# Altium schematic sheet MCU_STM32H723ZGT6.SchDoc: STM32F446 CNC
size C; Author: AM; CompanyName: Expatria Technologies; DrawnBy: A.Marles; Engineer: AM; Organization: Expatria Technologies; DocumentNumber: 3; SheetNumber: 3; SheetTotal: 14
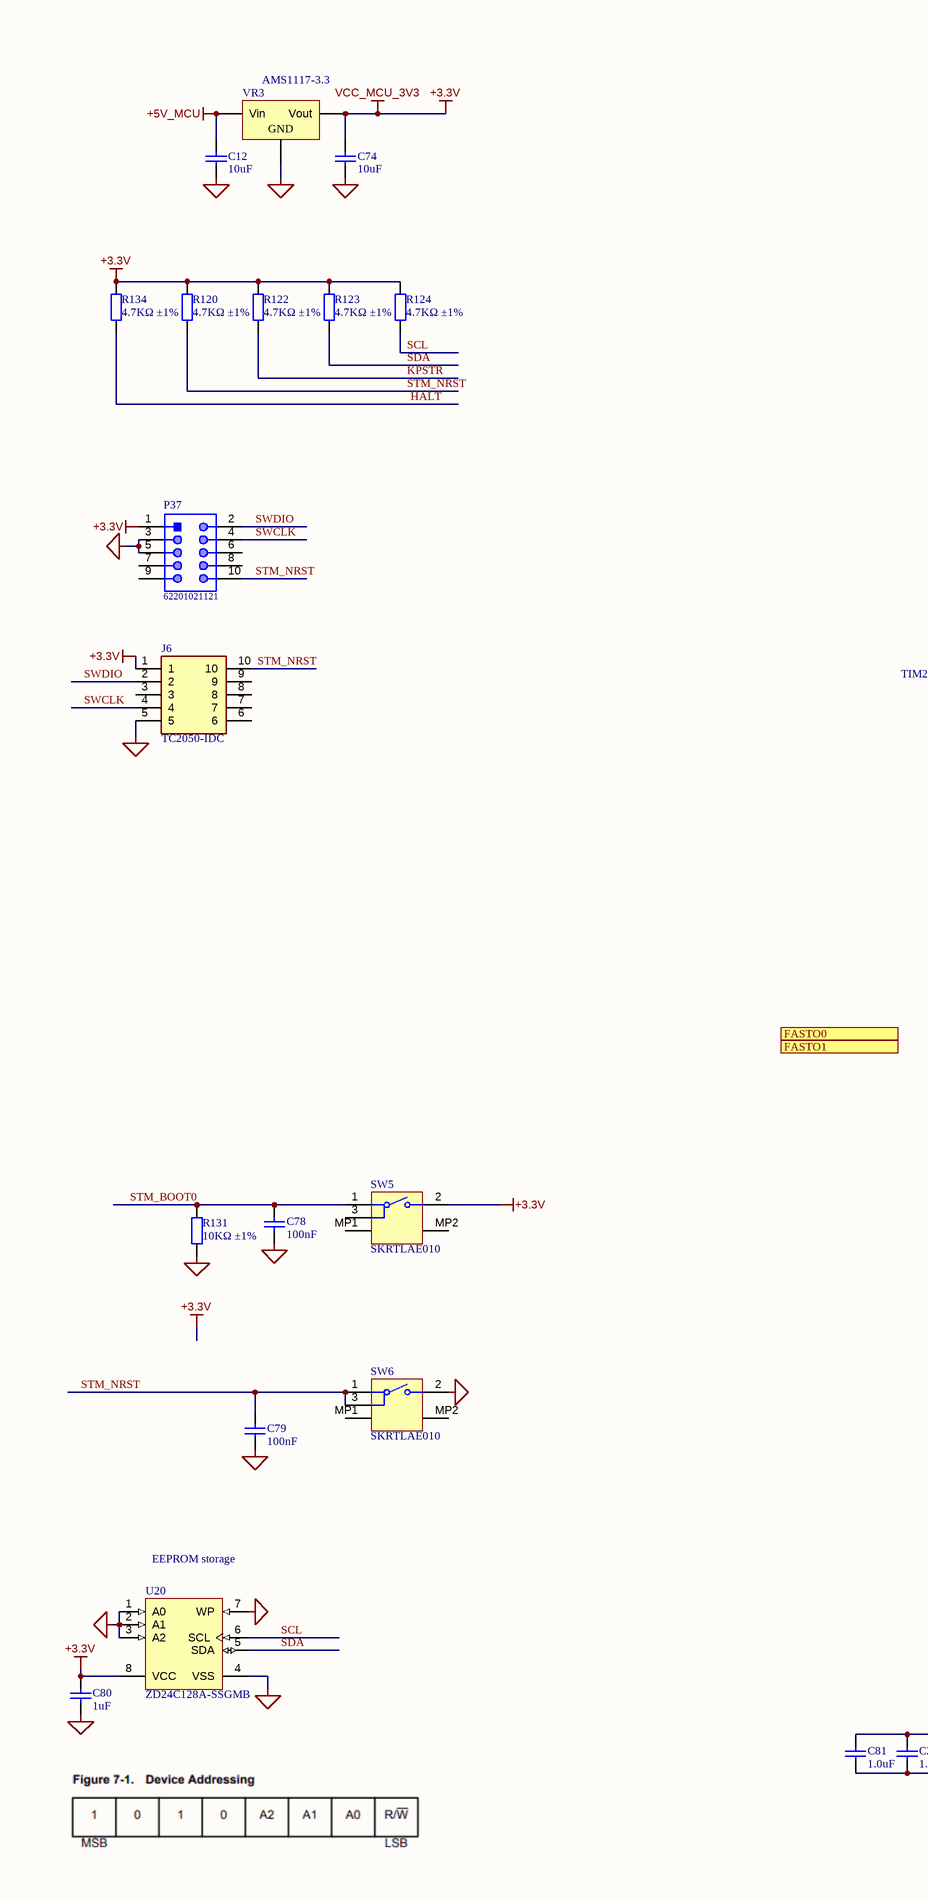
[diagram p0: MCU_STM32H723ZGT6.SchDoc, left]
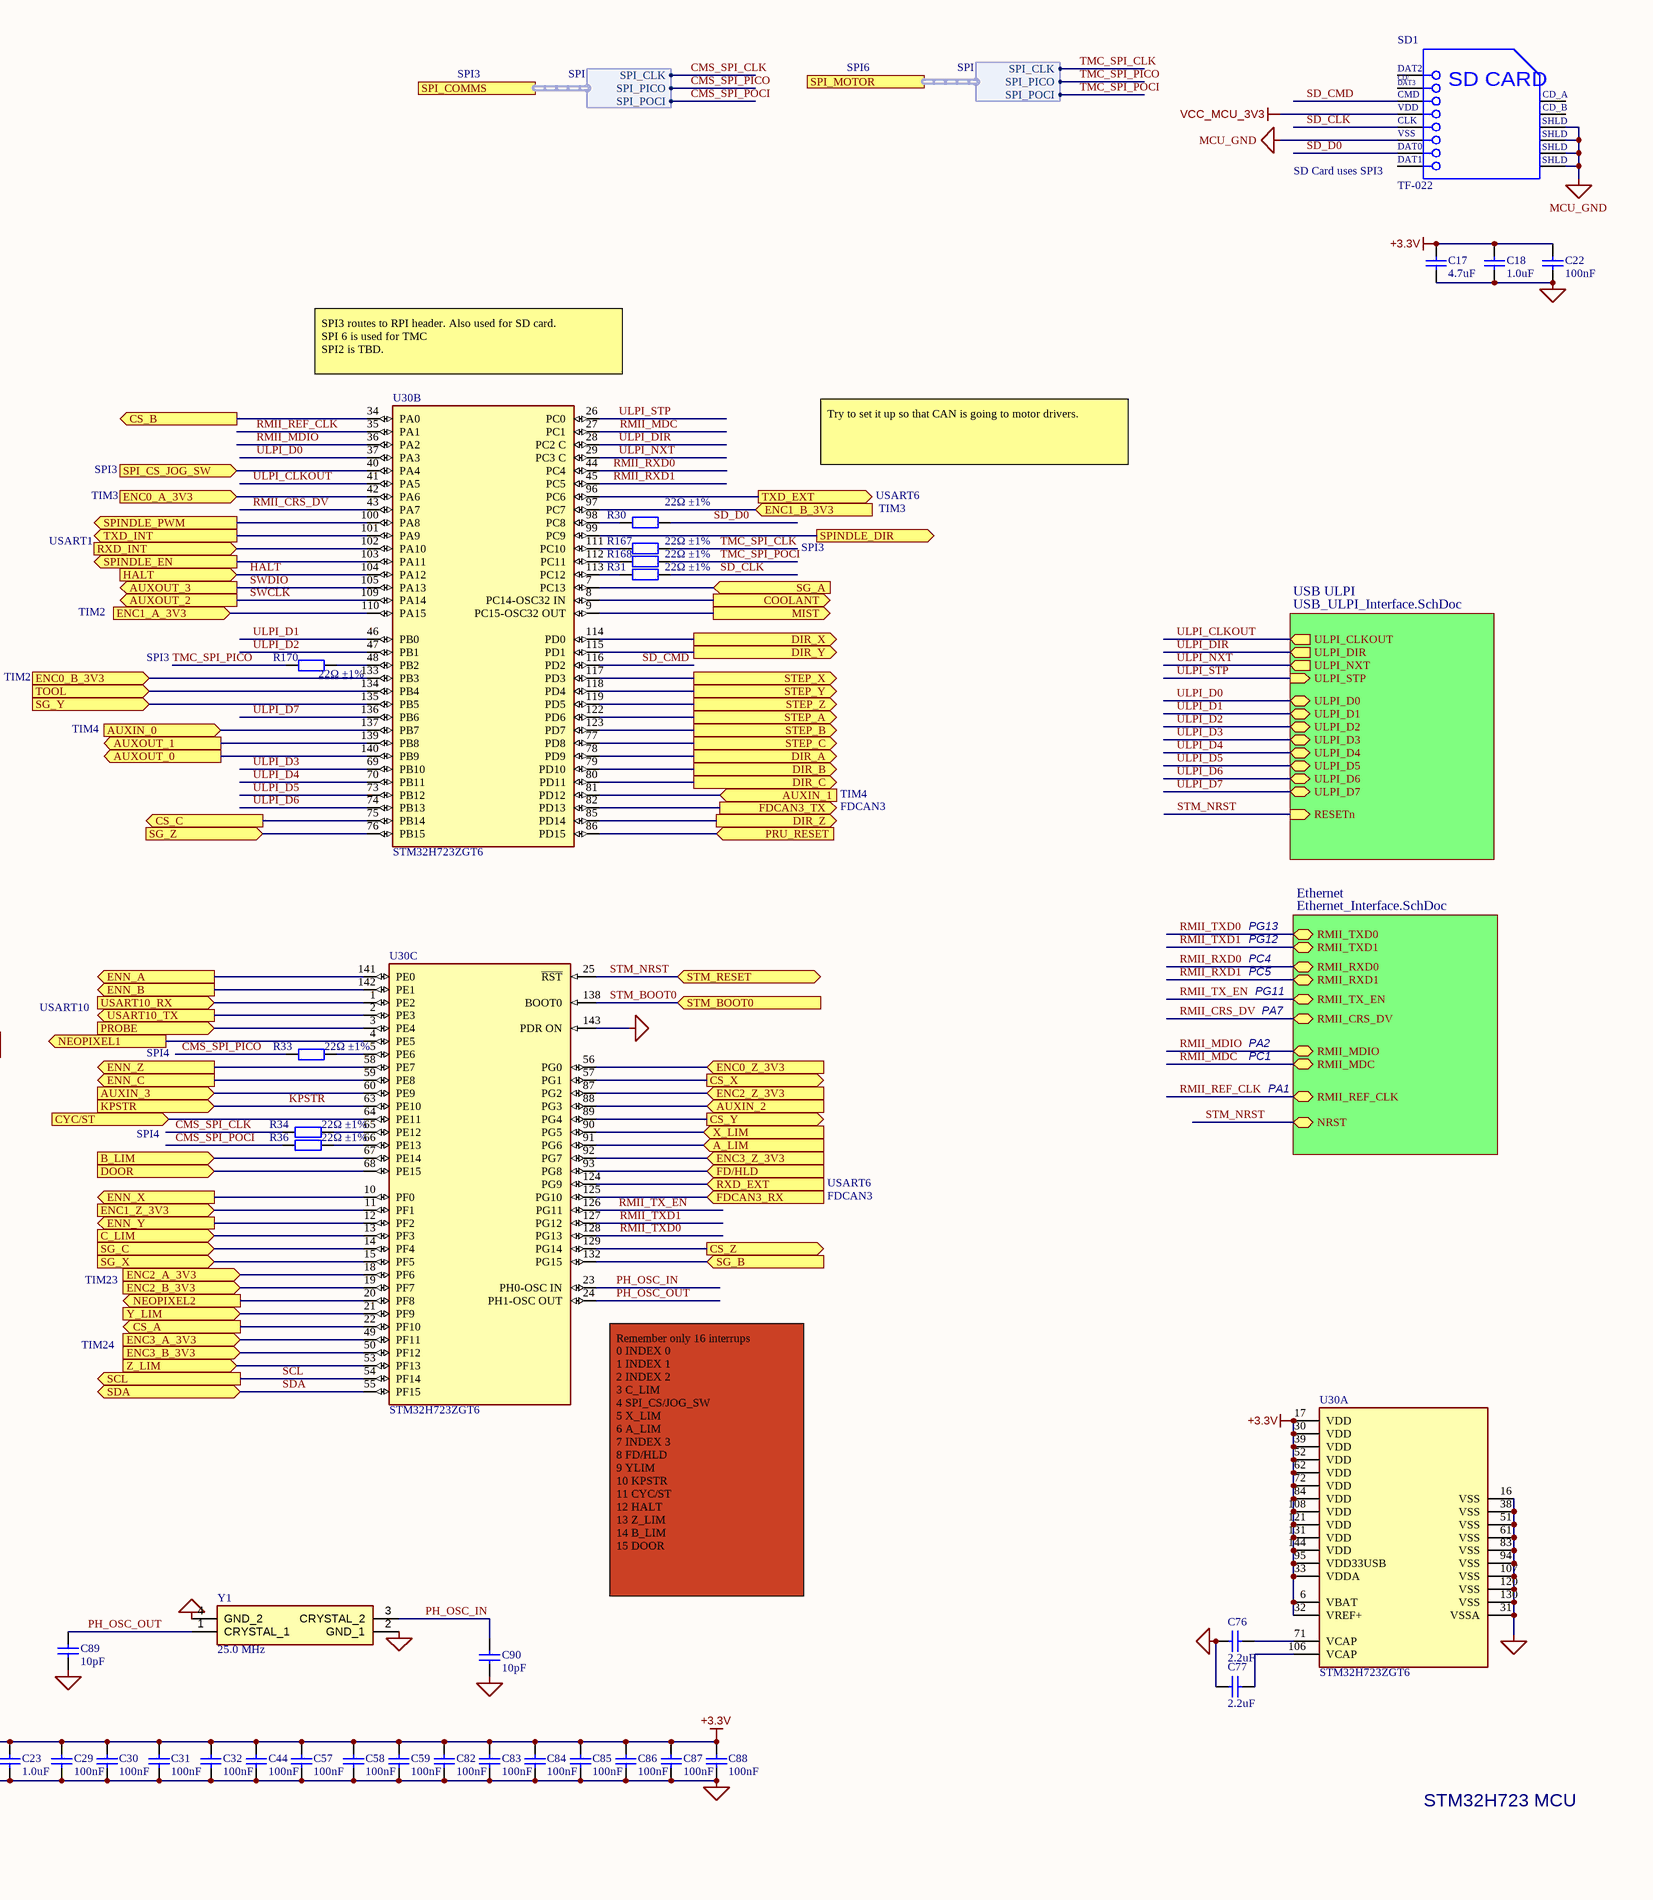
[diagram p1: MCU_STM32H723ZGT6.SchDoc, right]

## Parts
C12  10uF  [1206_C]
C17  4.7uF  [0603_C]
C18  1.0uF  [0402_C]
C22  100nF  [0402_C]
C23  1.0uF  [0402_C]
C29  100nF  [0402_C]
C30  100nF  [0402_C]
C31  100nF  [0402_C]
C32  100nF  [0402_C]
C44  100nF  [0402_C]
C57  100nF  [0402_C]
C58  100nF  [0402_C]
C59  100nF  [0402_C]
C74  10uF  [1206_C]
C76  2.2uF  [0603_C]
C77  2.2uF  [0603_C]
C78  100nF  [0603_C]
C79  100nF  [0603_C]
C80  1uF  [0603_C]
C81  1.0uF  [0402_C]
C82  100nF  [0402_C]
C83  100nF  [0402_C]
C84  100nF  [0402_C]
C85  100nF  [0402_C]
C86  100nF  [0402_C]
C87  100nF  [0402_C]
C88  100nF  [0402_C]
C89  10pF  [0402_C]
C90  10pF  [0402_C]
J6  TC2050-IDC  [TC2050-IDC]
P37  62201021121  [62201021121]  (no BOM)
R30  22Ω ±1%  [0402_R]
R31  22Ω ±1%  [0402_R]
R33  22Ω ±1%  [0402_R]
R34  22Ω ±1%  [0402_R]
R36  22Ω ±1%  [0402_R]
R120  4.7KΩ ±1%  [0603_R]
R122  4.7KΩ ±1%  [0603_R]
R123  4.7KΩ ±1%  [0603_R]
R124  4.7KΩ ±1%  [0603_R]
R131  10KΩ ±1%  [0603_R]
R134  4.7KΩ ±1%  [0603_R]
R167  22Ω ±1%  [0402_R]
R168  22Ω ±1%  [0402_R]
R170  22Ω ±1%  [0402_R]
SD1  TF-022  [MOLX-503398-1892_V]
SW5  SKRTLAE010  [ALPS-SKRTLAE010_V]
SW6  SKRTLAE010  [ALPS-SKRTLAE010_V]
U20  ZD24C128A-SSGMB  [SOIC-SN8_L]
U30  STM32H723ZGT6  [FP-LQFP144-1A-IPC_A]  (parts A,B,C of 3)
VR3  AMS1117-3.3  [SOT-223]
Y1  25.0 MHz  [YSX321SL]

## Sub-sheets
Ethernet = Ethernet_Interface.SchDoc: RMII_RXD1 (bidir), RMII_MDC (bidir), RMII_REF_CLK (bidir), RMII_MDIO (bidir), RMII_RXD0 (bidir), RMII_TX_EN (bidir), NRST (bidir), RMII_CRS_DV (bidir), RMII_TXD0 (bidir), RMII_TXD1 (bidir)
USB ULPI = USB_ULPI_Interface.SchDoc: ULPI_D5 (bidir), ULPI_D7 (bidir), ULPI_D6 (bidir), ULPI_D4 (bidir), ULPI_D0 (bidir), ULPI_D2 (bidir), ULPI_D3 (bidir), ULPI_D1 (bidir), ULPI_NXT (out), ULPI_DIR (out), ULPI_STP (in), ULPI_CLKOUT (out), RESETn (in)

## Ports
A_LIM (in), AUXIN_0 (in), AUXIN_1 (in), AUXIN_2 (in), AUXIN_3 (in), AUXOUT_0 (out), AUXOUT_1 (out), AUXOUT_2 (out), AUXOUT_3 (out), B_LIM (in), C_LIM (in), COOLANT (out), CS_A (out), CS_B (out), CS_C (out), CS_X (out), CS_Y (out), CS_Z (out), CYC/ST (in), DIR_A (out), DIR_B (out), DIR_C (out), DIR_X (out), DIR_Y (out), DIR_Z (out), DOOR (in), ENC0_A_3V3 (in), ENC0_B_3V3 (in), ENC0_Z_3V3 (in), ENC1_A_3V3 (in), ENC1_B_3V3 (in), ENC1_Z_3V3 (in), ENC2_A_3V3 (in), ENC2_B_3V3 (in), ENC2_Z_3V3 (in), ENC3_A_3V3 (in), ENC3_B_3V3 (in), ENC3_Z_3V3 (in), ENN_A (out), ENN_B (out), ENN_C (out), ENN_X (out), ENN_Y (out), ENN_Z (out), FASTO0 (out), FASTO1 (out), FD/HLD (in), FDCAN3_RX (in), FDCAN3_TX (out), HALT (in), KPSTR (in), MIST (out), NEOPIXEL1 (out), NEOPIXEL2 (out), PROBE (in), PRU_RESET (in), RXD_EXT (in), RXD_INT (in), SCL (out), SDA (bidir), SG_A (in), SG_B (in), SG_C (in), SG_X (in), SG_Y (in), SG_Z (in), SPI_COMMS (harness SPI), SPI_CS_JOG_SW (in), SPI_MOTOR (harness SPI), SPINDLE_DIR (out), SPINDLE_EN (out), SPINDLE_PWM (out), STEP_A (out), STEP_B (out), STEP_C (out), STEP_X (out), STEP_Y (out), STEP_Z (out), STM_BOOT0 (in), STM_RESET (bidir), TOOL (in), TXD_EXT (out), TXD_INT (out), USART10_RX (in), USART10_TX (out), X_LIM (in), Y_LIM (in), Z_LIM (in)

## Harnesses
SPI: SPI_CLK, SPI_PICO, SPI_POCI

## Nets
+3.3V: C17.2 C18.2 C22.2 C23.2 C29.2 C30.2 C31.2 C32.2 C44.2 C57.2 C58.2 C59.2 C74.2 C80.2 C81.2 C82.2 C83.2 C84.2 C85.2 C86.2 C87.2 C88.2 J6.1 P37.1 R120.2 R122.2 R123.2 R124.2 R134.2 SD1.4(VDD) SW5.2 U20.8(VCC) U30.6(VBAT) U30.17(VDD) U30.30(VDD) U30.32(VREF+) U30.33(VDDA) U30.39(VDD) U30.52(VDD) U30.62(VDD) U30.72(VDD) U30.84(VDD) U30.95(VDD33USB) U30.108(VDD) U30.121(VDD) U30.131(VDD) U30.144(VDD) VR3.2(Vout)  [also labelled VCC_MCU_3V3]
+5V_MCU: C12.2 VR3.3(Vin)
MCU_GND: C12.1 C17.1 C18.1 C22.1 C23.1 C29.1 C30.1 C31.1 C32.1 C44.1 C57.1 C58.1 C59.1 C74.1 C76.1 C77.1 C78.1 C79.1 C80.1 C81.1 C82.1 C83.1 C84.1 C85.1 C86.1 C87.1 C88.1 C89.1 C90.1 J6.5 P37.3 P37.5 R131.2 SD1.6(VSS) SD1.11(SHLD) SD1.12(SHLD) SD1.13(SHLD) SD1.14(SHLD) SW6.2 U20.1(A0) U20.2(A1) U20.3(A2) U20.4(VSS) U20.7(WP) U30.16(VSS) U30.31(VSSA) U30.38(VSS) U30.51(VSS) U30.61(VSS) U30.83(VSS) U30.94(VSS) U30.107(VSS) U30.120(VSS) U30.130(VSS) U30.143(PDR_ON) VR3.1(GND) Y1.2(GND_1) Y1.4(GND_2)
A_LIM: U30.91(PG6) ; port A_LIM
AUXIN_0: U30.137(PB7) ; port AUXIN_0
AUXIN_1: U30.81(PD12) ; port AUXIN_1
AUXIN_2: U30.88(PG3) ; port AUXIN_2
AUXIN_3: U30.60(PE9) ; port AUXIN_3
AUXOUT_0: U30.140(PB9) ; port AUXOUT_0
AUXOUT_1: U30.139(PB8) ; port AUXOUT_1
B_LIM: U30.67(PE14) ; port B_LIM
C_LIM: U30.13(PF3) ; port C_LIM
CMS_SPI_CLK: R34.1 ; port SPI_COMMS.SPI_CLK
CMS_SPI_PICO: R33.1 ; port SPI_COMMS.SPI_PICO
CMS_SPI_POCI: R36.1 ; port SPI_COMMS.SPI_POCI
COOLANT: U30.8(PC14-OSC32_IN) ; port COOLANT
CS_A: U30.22(PF10) ; port CS_A
CS_B: U30.34(PA0) ; port CS_B
CS_C: U30.75(PB14) ; port CS_C
CS_X: U30.57(PG1) ; port CS_X
CS_Y: U30.89(PG4) ; port CS_Y
CS_Z: U30.129(PG14) ; port CS_Z
CYC/ST: U30.64(PE11) ; port CYC/ST
DIR_A: U30.78(PD9) ; port DIR_A
DIR_B: U30.79(PD10) ; port DIR_B
DIR_C: U30.80(PD11) ; port DIR_C
DIR_X: U30.114(PD0) ; port DIR_X
DIR_Y: U30.115(PD1) ; port DIR_Y
DIR_Z: U30.85(PD14) ; port DIR_Z
DOOR: U30.68(PE15) ; port DOOR
ENC0_A_3V3: U30.42(PA6) ; port ENC0_A_3V3
ENC0_B_3V3: U30.133(PB3) ; port ENC0_B_3V3
ENC0_Z_3V3: U30.56(PG0) ; port ENC0_Z_3V3
ENC1_A_3V3: U30.110(PA15) ; port ENC1_A_3V3
ENC1_B_3V3: U30.97(PC7) ; port ENC1_B_3V3
ENC1_Z_3V3: U30.11(PF1) ; port ENC1_Z_3V3
ENC2_A_3V3: U30.18(PF6) ; port ENC2_A_3V3
ENC2_B_3V3: U30.19(PF7) ; port ENC2_B_3V3
ENC2_Z_3V3: U30.87(PG2) ; port ENC2_Z_3V3
ENC3_A_3V3: U30.49(PF11) ; port ENC3_A_3V3
ENC3_B_3V3: U30.50(PF12) ; port ENC3_B_3V3
ENC3_Z_3V3: U30.92(PG7) ; port ENC3_Z_3V3
ENN_A: U30.141(PE0) ; port ENN_A
ENN_B: U30.142(PE1) ; port ENN_B
ENN_C: U30.59(PE8) ; port ENN_C
ENN_X: U30.10(PF0) ; port ENN_X
ENN_Y: U30.12(PF2) ; port ENN_Y
ENN_Z: U30.58(PE7) ; port ENN_Z
FD/HLD: U30.93(PG8) ; port FD/HLD
FDCAN3_RX: U30.125(PG10) ; port FDCAN3_RX
FDCAN3_TX: U30.82(PD13) ; port FDCAN3_TX
HALT: R134.1 U30.104(PA12) ; port HALT
KPSTR: R122.1 U30.63(PE10) ; port KPSTR
MIST: U30.9(PC15-OSC32_OUT) ; port MIST
NEOPIXEL1: U30.4(PE5) ; port NEOPIXEL1
NEOPIXEL2: U30.20(PF8) ; port NEOPIXEL2
PH_OSC_IN: C90.2 U30.23(PH0-OSC_IN) Y1.3(CRYSTAL_2)
PH_OSC_OUT: C89.2 U30.24(PH1-OSC_OUT) Y1.1(CRYSTAL_1)
PROBE: U30.3(PE4) ; port PROBE
PRU_RESET: U30.86(PD15) ; port PRU_RESET
RMII_CRS_DV: U30.43(PA7) ; sheet Ethernet/RMII_CRS_DV
RMII_MDC: U30.27(PC1) ; sheet Ethernet/RMII_MDC
RMII_MDIO: U30.36(PA2) ; sheet Ethernet/RMII_MDIO
RMII_REF_CLK: U30.35(PA1) ; sheet Ethernet/RMII_REF_CLK
RMII_RXD0: U30.44(PC4) ; sheet Ethernet/RMII_RXD0
RMII_RXD1: U30.45(PC5) ; sheet Ethernet/RMII_RXD1
RMII_TX_EN: U30.126(PG11) ; sheet Ethernet/RMII_TX_EN
RMII_TXD0: U30.128(PG13) ; sheet Ethernet/RMII_TXD0
RMII_TXD1: U30.127(PG12) ; sheet Ethernet/RMII_TXD1
RXD_EXT: U30.124(PG9) ; port RXD_EXT
RXD_INT: U30.102(PA10) ; port RXD_INT
SCL: R124.1 U20.6(SCL) U30.54(PF14) ; port SCL
SD_CLK: R31.2 SD1.5(CLK)
SD_CMD: SD1.3(CMD) U30.116(PD2)
SD_D0: R30.2 SD1.7(DAT0)
SDA: R123.1 U20.5(SDA) U30.55(PF15) ; port SDA
SG_A: U30.7(PC13) ; port SG_A
SG_B: U30.132(PG15) ; port SG_B
SG_C: U30.14(PF4) ; port SG_C
SG_X: U30.15(PF5) ; port SG_X
SG_Y: U30.135(PB5) ; port SG_Y
SG_Z: U30.76(PB15) ; port SG_Z
SPI_CS_JOG_SW: U30.40(PA4) ; port SPI_CS_JOG_SW
SPINDLE_DIR: U30.99(PC9) ; port SPINDLE_DIR
SPINDLE_EN: U30.103(PA11) ; port SPINDLE_EN
SPINDLE_PWM: U30.100(PA8) ; port SPINDLE_PWM
STEP_A: U30.122(PD6) ; port STEP_A
STEP_B: U30.123(PD7) ; port STEP_B
STEP_C: U30.77(PD8) ; port STEP_C
STEP_X: U30.117(PD3) ; port STEP_X
STEP_Y: U30.118(PD4) ; port STEP_Y
STEP_Z: U30.119(PD5) ; port STEP_Z
STM_BOOT0: C78.2 R131.1 SW5.1 U30.138(BOOT0) ; port STM_BOOT0
STM_NRST: C79.2 J6.10 P37.10 R120.1 SW6.1 SW6.3 U30.25(~{RST}) ; port STM_RESET, sheet Ethernet/NRST, sheet USB ULPI/RESETn
SWCLK: J6.4 P37.4 U30.109(PA14) ; port AUXOUT_2
SWDIO: J6.2 P37.2 U30.105(PA13) ; port AUXOUT_3
TMC_SPI_CLK: R167.2 ; port SPI_MOTOR.SPI_CLK
TMC_SPI_PICO: R170.1 ; port SPI_MOTOR.SPI_PICO
TMC_SPI_POCI: R168.2 ; port SPI_MOTOR.SPI_POCI
TOOL: U30.134(PB4) ; port TOOL
TXD_EXT: U30.96(PC6) ; port TXD_EXT
TXD_INT: U30.101(PA9) ; port TXD_INT
ULPI_CLKOUT: U30.41(PA5) ; sheet USB ULPI/ULPI_CLKOUT
ULPI_D0: U30.37(PA3) ; sheet USB ULPI/ULPI_D0
ULPI_D1: U30.46(PB0) ; sheet USB ULPI/ULPI_D1
ULPI_D2: U30.47(PB1) ; sheet USB ULPI/ULPI_D2
ULPI_D3: U30.69(PB10) ; sheet USB ULPI/ULPI_D3
ULPI_D4: U30.70(PB11) ; sheet USB ULPI/ULPI_D4
ULPI_D5: U30.73(PB12) ; sheet USB ULPI/ULPI_D5
ULPI_D6: U30.74(PB13) ; sheet USB ULPI/ULPI_D6
ULPI_D7: U30.136(PB6) ; sheet USB ULPI/ULPI_D7
ULPI_DIR: U30.28(PC2_C) ; sheet USB ULPI/ULPI_DIR
ULPI_NXT: U30.29(PC3_C) ; sheet USB ULPI/ULPI_NXT
ULPI_STP: U30.26(PC0) ; sheet USB ULPI/ULPI_STP
USART10_RX: U30.1(PE2) ; port USART10_RX
USART10_TX: U30.2(PE3) ; port USART10_TX
X_LIM: U30.90(PG5) ; port X_LIM
Y_LIM: U30.21(PF9) ; port Y_LIM
Z_LIM: U30.53(PF13) ; port Z_LIM
NetC76_2: C76.2 U30.71(VCAP)
NetC77_2: C77.2 U30.106(VCAP)
NetR30_1: R30.1 U30.98(PC8)
NetR31_1: R31.1 U30.113(PC12)
NetR33_2: R33.2 U30.5(PE6)
NetR34_2: R34.2 U30.65(PE12)
NetR36_2: R36.2 U30.66(PE13)
NetR167_1: R167.1 U30.111(PC10)
NetR168_1: R168.1 U30.112(PC11)
NetR170_2: R170.2 U30.48(PB2)

Not connected (* = marked no-connect by the designer): J6 3 6 7 8 9; P37 6 7 8 9; SD1 1(DAT2) 2(CD/DAT3) 8(DAT1) 9(CD_A) 10(CD_B); SW5 3 MP1 MP2; SW6 MP1 MP2

## Notes on the sheet
- SPI6
- SPI3
- (near SD1) SD Card uses SPI3
- (near U30) SPI3 routes to RPI header. Also used for SD card.
  SPI 6 is used for TMC
  SPI2 is TBD.
- Try to set it up so that CAN is going to motor drivers.
- TIM3
- USART6
- USART1
- TIM2
- TIM4
- FDCAN3
- PG13
- PG12
- PC4
- PC5
- USART10
- PA2
- PG11
- PA7
- SPI4
- PC1
- PA1
- TIM23
- TIM24
- (near U20) EEPROM storage
- (near U30) Remember only 16 interrups
  0 INDEX 0
  1 INDEX 1
  2 INDEX 2
  3 C_LIM
  4 SPI_CS/JOG_SW
  5 X_LIM
  6 A_LIM
  7 INDEX 3
  8 FD/HLD
  9 YLIM
  10 KPSTR
  11 CYC/ST
  12 HALT
  13 Z_LIM
  14 B_LIM
  15 DOOR
- STM32H723 MCU
- Expatria Technologies
- SHEET
- PROJECT
- REV
- 1136 Glade Court
- Port Coquitlam, BC V3B 1R5
- EMAIL: INFO@EXPATRIA.CA
- SIZE
- ENGR
- C
- MODIFIED
- DOCUMENT
- /
- Copyright Expatria Technologies 2023. This document describes Open Hardware and is licensed under the CERN-OHL-S v2. No warranty is implied or expressed.
- (in symbol TF-022) CD/; DAT3; SD CARD

## Library data of the parts
C12 C74 = 1206 10uF (106) 10% 50V: Chip capacitors; Manufacturer: Samsung Electro-Mechanics; PartNumber: CL31A106KBHNNNE; Tolerance: 10%; Voltage: 50V; ComponentLink1Description: Supplier link; ComponentLink1URL: http://www.szlcsc.com/product/details_14236.html; Package: 1206; Supplier: LC; SuppliersPartNumber: C13585; Capacitance: 10uF; Manufacturer 1: Samsung Electro-Mechanics
C17 = 0603 4.7uF (475) 10% 16V: 16V 4.7uF X5R ±10% 0603 Multilayer Ceramic Capacitors MLCC - SMD/SMT ROHS; Manufacturer: Samsung Electro-Mechanics; Manufacturer Part Number: CL10A475KO8NNNC; ComponentLink1Description: Supplier link; ComponentLink1URL: http://www.szlcsc.com/product/details_20375.html; Package: 0603; Supplier: LC; SuppliersPartNumber: C19666; Capacitance: 4.7uF; Tolerance: 10%; Voltage: 16V
C18 = 0402 1.0uF (105) 10% 25V: Chip capacitor; Manufacturer: Samsung Electro-Mechanics; Manufacturer Part Number: CL05A105KA5NQNC; Capacitance: 1uF; Tolerance: 10%; Voltage: 25V; ComponentLink1Description: Supplier link; ComponentLink1URL: http://www.szlcsc.com/product/details_53938.html; Package: 0402; Supplier: LC; SuppliersPartNumber: C52923
C22 = 0402 100nF (104) 10% 16V: 16V 100nF X7R ±10% 0402 Multilayer Ceramic Capacitors MLCC - SMD/SMT ROHS; Manufacturer: Samsung Electro-Mechanics; Manufacturer Part Number: CL05B104KO5NNNC; ComponentLink1Description: Supplier link; ComponentLink1URL: http://www.szlcsc.com/product/details_1877.html; Package: 0402; Supplier: LC; SuppliersPartNumber: C1525; Capacitance: 100nF; Tolerance: 10%; Voltage: 16V
C23 C81 = 0402 1.0uF (105) 10% 25V: Chip capacitor; Manufacturer: Samsung Electro-Mechanics; PartNumber: CL05A105KA5NQNC; Capacitance: 1uF; Tolerance: 10%; Voltage: 25V; ComponentLink1Description: Supplier link; ComponentLink1URL: http://www.szlcsc.com/product/details_53938.html; Package: 0402; Supplier: LC; SuppliersPartNumber: C52923
C29-C32 C44 C57-C59 C82-C88 = 0402 100nF (104) 10% 16V: Chip capacitors; Manufacturer: Samsung Electro-Mechanics; PartNumber: CL05B104KO5NNNC; Tolerance: 10%; Voltage: 16V; ComponentLink1Description: Supplier link; ComponentLink1URL: http://www.szlcsc.com/product/details_1877.html; Package: 0402; Supplier: LC; SuppliersPartNumber: C1525; Capacitance: 100nF
C76 C77 = 0603 2.2uF (225) 10% 16V: Chip capacitors; Manufacturer: Samsung Electro-Mechanics; PartNumber: CL10A225KO8NNNC; Tolerance: 10%; Voltage: 16V; ComponentLink1Description: Supplier link; ComponentLink1URL: http://www.szlcsc.com/product/details_24366.html; Package: 0603; Supplier: LC; SuppliersPartNumber: C23630; Capacitance: 2.2uF
C78 C79 = 0603 100nF (104) 10% 50V: Chip capacitors; Manufacturer: YAGEO; PartNumber: CC0603KRX7R9BB104; Tolerance: 10%; Voltage: 50V; ComponentLink1Description: Supplier link; ComponentLink1URL: http://www.szlcsc.com/product/details_15331.html; Package: 0603; Supplier: LC; SuppliersPartNumber: C14663; Capacitance: 100nF
C80 = 0603 1uF (105) 10% 50V: Chip capacitors; Manufacturer: Samsung Electro-Mechanics; PartNumber: CL10A105KB8NNNC; Tolerance: 10%; Voltage: 50V; Package: 0603; Supplier: LC; SuppliersPartNumber: C15849; Capacitance: 1uF; ComponentLink1Description: Supplier link; ComponentLink1URL: http://www.szlcsc.com/product/details_16531.html
C89 C90 = 0402 10pF (100) 5% 50V: Chip capacitors; Manufacturer: Samsung Electro-Mechanics; PartNumber: CL05C100JB5NNNC; Tolerance: 5%; Voltage: 50V; ComponentLink1Description: Supplier link; ComponentLink1URL: http://www.szlcsc.com/product/details_33914.html; Package: 0402; Supplier: LC; SuppliersPartNumber: C32949; Capacitance: 10pF
J6 = TC2050-IDC: Connector; Manufacturer_Name: Tag Connect; Datasheet Link: https://datasheet.datasheetarchive.com/originals/distributors/Datasheets_SAMA/51f607a36a24a0aceedaa5d6ebc30014.pdf; Manufacturer_Part_Number: TC2050-IDC
P37 = CMP-1502-00948-1: THT Vertical Pin Header WR-PHD, Pitch 1.27 mm, Dual Row, 10 pins; Manufacturer: Wurth Elektronik; Rated Current: 1A; Pin Number: 10; Working Voltage: 100VAC; Contact Resistance: 20mOhm; Withstanding Voltage: 500VAC; Pitch: 1.27mm; Gender: Male; Mounting Technology: THT; Manufacturer URL: http://www.we-online.de; Package Reference: 62201021121; Row Number: Dual; Datasheet URL: https://katalog.we-online.de/em/datasheet/62201021121.pdf; Publisher: WurthElektronik; Packaging: Box; Operating Temperature: -40to105degC; Orientation: Vertical; Part Number: 62201021121
R30 R31 R33 R34 R36 R167 R168 R170 = 0402 22R (22R0) 1%: Chip resistor; Manufacturer: Uniroyal Elec; PartNumber: 0402WGF220JTCE; Power: 1/16W; ComponentLink1Description: Supplier link; ComponentLink1URL: http://www.szlcsc.com/product/details_25835.html; Package: 0402; Supplier: LC; SuppliersPartNumber: C25092; Resistance: 22Ω; Tolerance: 1%
R120 R122-R124 R134 = 0603 4.7K (4701) 1%: Chip resistor; Manufacturer: Uniroyal Elec; PartNumber: 0603WAF4701T5E; Power: 1/10W; ComponentLink1Description: Supplier link; ComponentLink1URL: http://www.szlcsc.com/product/details_23889.html; Package: 0603; Supplier: LC; SuppliersPartNumber: C23162; Resistance: 4.7KΩ; Tolerance: 1%
R131 = 0603 10K (1002) 1%: Chip resistor; Manufacturer: Uniroyal Elec; PartNumber: 0603WAF1002T5E; Power: 1/10W; ComponentLink1Description: Supplier link; ComponentLink1URL: http://www.szlcsc.com/product/details_26547.html; Package: 0603; Supplier: LC; SuppliersPartNumber: C25804; Resistance: 10KΩ; Tolerance: 1%
SD1 = TF-022: -40℃~+85℃ 1.28mm Gold plating Deck MicroSD card (TF card) Self bomb SMD SD Card Connectors ROHS; Manufacturer: Hanbo Electronic; SuppliersPartNumber: C2962373; Manufacturer Part Number: TF-022; Value: TF-022
SW5 SW6 = CMP-2000-07073-2: Side Push Type, 250 V, -40 to 90 degC, 3-Pin SMD, RoHS, Tape and Reel; Manufacturer: ALPS; Operating Force: 1.6N; Folder: Unified Components\Components\New Releases\New\; Maximum Current Rating: 0.05@12VDCA; RevisionId: 1; Pole Throw Configuration: SPST; Switch Configuration: N.O.; AccessRights: 2147483647; Maximum DC Voltage Rating: 12V; ContentType: Unified Component; Rad Hard: No; Mounting: SurfaceMount; Datasheet URL: http://www.alps.com/prod/info/E/PDF/Tact/SurfaceMount/SKRT/SKRT.PDF; Manufacturer URL: http://www.alps.com/e/; ReleaseDate: 22/09/2017 06:13:25 AM; ItemHRID: CMP-2000-07073; ContentTypeGUID: CB3C11C4-E317-11DF-B822-12313F0024A2; LifeCycle: Released; ItemGUID: EAC55BEC-37DC-4BDB-8BA7-D75E6D5C3D75; Packaging: Tape&Reel; Package Reference: SKRTLAE010; FolderGUID: B7F4506A-9127-42E7-A087-46FE7B18D116; Datasheet Version: 06/2015; Mounting Technology: SurfaceMount; LifeCycleStateGUID: 61E382EE-6656-4F12-9E24-BE9327104A25; Package Description: 3-Pin Surface Mount Device, Body 4.5 x 3.55 mm, Pitch 1.225 mm; SuppliersPartNumber: C110293; Manufacturer 1: ALPS
U20 = CMP-0159-00216-1: IC EEPROM 128KBIT I2C 8SOIC; SuppliersPartNumber: C918271
U30 = STM32H723ZGT6: IC MCU 32BIT 1MB FLASH 144LQFP; Manufacturer 1: STMicroelectronics; Manufacturer Part Number 1: STM32H723ZGT6
VR3 = SOT-223 AMS1117-3.3: Vout=3.3V 1A 72dB@(120Hz) (LDO); Manufacturer 1: AMS; ComponentLink1Description: 供应商链接; ComponentLink1URL: http://www.szlcsc.com/product/details_6652.html; Package: SOT-223; Supplier: LC; SuppliersPartNumber: C6186; Manufacturer Part Number 1: AMS1117-3.3
Y1 = YSX321SL: Crystal or Oscillator; Manufacturer_Name: Yangxing Tech; Manufacturer_Part_Number: X322525MSB4SI; Height: 0.8mm; SuppliersPartNumber: C13740